# Altium schematic sheet AFE.SchDoc: Plant - AFE
size A4; Author: Carlos de la Fuente; CompanyName: ekuore; DrawnBy: Carlos de la Fuente; Engineer: Carlos de la Fuente; Organization: eKuore; Revision: 0.2; SheetNumber: 4; SheetTotal: 5
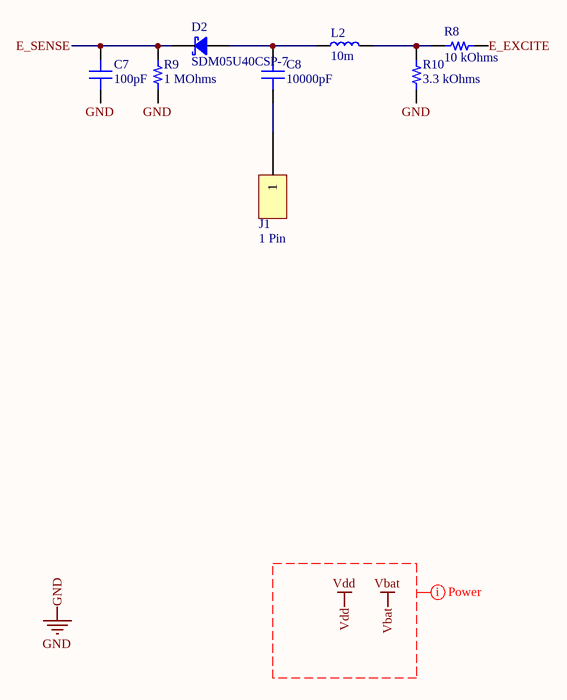
[diagram p0: AFE.SchDoc]

## Parts
C7  100pF  [CAP 0201_0603]
C8  10000pF  [CAP 0201_0603]
D2  SDM05U40CSP-7  [DIODES X3-WLB1006-2]
J1  1 Pin  [HARWIN P70-5100045R]
L2  10m  [IND BOURNS SDR0503]
R8  10 kOhms  [RES 0201_0603]
R9  1 MOhms  [RES 0201_0603]
R10  3.3 kOhms  [RES 0201_0603]

## Nets
GND: C7.1 R9.2 R10.1
E_EXCITE: R8.2
E_SENSE: C7.2 D2.1(K) R9.1
NetC8_1: C8.1 D2.2(A) L2.1
NetC8_2: C8.2 J1.1
NetL2_2: L2.2 R8.1 R10.2

## Layout directives
net class Power: Vbat, Vdd

## Notes on the sheet
- Title
- Size:
- Date:
- A4
- Project:
- Time:
- Sheet
- Drawn By:
- Revision:
- of
- File:

## Library data of the parts
C7 = GRM0335C1H101GA01D: CAP CER 100PF 50V C0G/NP0 0201; Manufacturer: Murata Electronics; Temperature Coefficient: C0G, NP0; Tolerance: ±2%; Part Number: GRM0335C1H101GA01D; Value: 100pF; Applications: General Purpose; Capacitance: 100pF; ComponentLink1Description: Datasheet; ComponentLink1URL: https://search.murata.co.jp/Ceramy/image/img/A01X/G101/ENG/GRM0335C1H101GA01-01.pdf; ComponentLink2Description: DigiKey Link; ComponentLink2URL: http://digikey.com/product-detail/en/murata-electronics/GRM0335C1H101GA01D/490-7751-1-ND/4357967; Device Package: 0201 (0603 Metric); LastUpdated: 02/09/2020 0:58:53; Lifecycle Status: Active; Minimum Order: 1; Mounting Type: Surface Mount, MLCC; Operating Temperature: -55°C ~ 125°C; Package / Case: 0201 (0603 Metric); Packaging: CutTape; PartId: 1001; Part Status: Active; Price: 0.10; Series: GRM; Size / Dimension: 0.024" L x 0.012" W (0.60mm x 0.30mm); Supplier 1: DigiKey; Supplier Part Number 1: 490-7751-1-ND; Thickness (Max): 0.013" (0.33mm); Voltage - Rated: 50V
C8 = GRM033R61A103KA01D: CAP CER 10000PF 10V X5R 0201; Manufacturer: Murata Electronics; Tolerance: ±10%; Part Number: GRM033R61A103KA01D; Value: 10000pF; Applications: General Purpose; Capacitance: 10000pF; ComponentLink1Description: Datasheet; ComponentLink1URL: https://www.murata.com/~/media/webrenewal/support/library/catalog/products/capacitor/mlcc/c02e.ashx?la=en-us; ComponentLink2Description: DigiKey Link; ComponentLink2URL: http://digikey.com/product-detail/en/murata-electronics/GRM033R61A103KA01D/490-3166-1-ND/702707; Device Package: 0201 (0603 Metric); LastUpdated: 02/09/2020 0:59:28; Lifecycle Status: Active; Minimum Order: 1; Mounting Type: Surface Mount, MLCC; Operating Temperature: -55°C ~ 85°C; Package / Case: 0201 (0603 Metric); Packaging: CutTape; PartId: 601; Part Status: Active; Price: 0.10; Series: GRM; Size / Dimension: 0.024" L x 0.012" W (0.60mm x 0.30mm); Supplier 1: DigiKey; Supplier Part Number 1: 490-3166-1-ND; Temperature Coefficient: X5R; Thickness (Max): 0.013" (0.33mm); Voltage - Rated: 10V
D2 = SDM05U40CSP-7: DIODE SCHTKY 40V 0.5A X3WLB1006; Manufacturer: Diodes; Capacitance: 3.5E-11F; Part Number: SDM05U40CSP-7; Revision Date: 19/07/2021; Creation Date: 19/07/2021; Supplier 1: Digi-Key; Supplier Part Number 1: SDM05U40CSP-7DICT-ND; Manufacturer Part Number: SDM05U40CSP-7; Stock 1: 220954; RoHS: Yes; Number of Pins: 2; Min Operating Temperature: -55°C; Max Operating Temperature: 150°C; Packaging: Tape and Reel; Mount: Surface Mount; Manufacturer 1: Diodes; Manufacturer Part Number 1: SDM05U40CSP-7
J1 = P70-5100045R: POGO PIN 4MM SMD; Manufacturer: Harwin; Plating: Gold; Current Rating: 2A; Part Number: P70-5100045R; Value: Pogo Pin; Creation Date: 22/06/2021; Revision Date: 22/06/2021; Supplier 1: Digi-Key; Supplier Part Number 1: 952-3125-ND; Manufacturer Part Number: P70-5100045; Stock 1: 2171; RoHS: Yes; Mount: Surface Mount; Material: Brass; Length: 4.8mm; REACH SVHC: No SVHC; ComponentLink1URL: https://cdn.harwin.com/pdfs/P70-510.pdf?src-supplier=Digi-Key; ComponentLink1Description: https://cdn.harwin.com/pdfs/P70-510.pdf?src-supplier=Digi-Key; ComponentLink2URL: http://www.farnell.com/datasheets/2151574.pdf?src-supplier=Element14; ComponentLink2Description: http://www.farnell.com/datasheets/2151574.pdf?src-supplier=Element14; Manufacturer 1: Harwin; Manufacturer Part Number 1: P70-5100045; RoHS Compliant: Yes
L2 = SDR0503-103JL: IND (0503) 10mH +-5% 0.04A 110R; Manufacturer: Bourns; Tolerance: 5%; Core Material: Ferrite; Self Resonant Frequency: 1MHz; Shielding: Unshielded; Q Factor: 30; Current Rating: 27mA; Test Frequency: 1kHz; Current: 59mA; Saturation Current: 40mA; Value: 10m; Part Number: SDR0503-103JL; Creation Date: 22/06/2021; Revision Date: 22/06/2021; Supplier 1: Digi-Key; Supplier Part Number 1: SDR0503-103JLCT-ND; Manufacturer Part Number: SDR0503-103JL; Stock 1: 3024; RoHS: Yes; Mount: Surface Mount; Case/Package: 0503; Number of Pins: 2; Min Operating Temperature: -40°C; Max Operating Temperature: 125°C; Resistance: 110R; Packaging: Tape and Reel; Length: 5mm; Height: 3.3mm; Width: 3mm; Depth: 5.1mm; REACH SVHC: No SVHC; ComponentLink1URL: https://datasheet.ciiva.com/8515/sdr0503-8515929.pdf?src-supplier=Avnet; ComponentLink1Description: https://datasheet.ciiva.com/8515/sdr0503-8515929.pdf?src-supplier=Avnet; Package Quantity: 500; Termination: SMD/SMT; Military Standard: Not; Height - Seated (Max): 0.13inch; Radiation Hardening: No; ComponentLink2URL: https://datasheet.ciiva.com/6691/sdr0503-6691389.p; ComponentLink2Description: https://datasheet.ciiva.com/6691/sdr0503-6691389.p; ComponentLink3URL: https://datasheet.ciiva.com/6691/sdr0503-6691390.p; ComponentLink3Description: https://datasheet.ciiva.com/6691/sdr0503-6691390.p; ComponentLink4URL: https://datasheet.ciiva.com/6691/sdr0503-6691391.p; ComponentLink4Description: https://datasheet.ciiva.com/6691/sdr0503-6691391.p; ComponentLink5URL: https://datasheet.ciiva.com/8517/sdr0503-8517757.p; ComponentLink5Description: https://datasheet.ciiva.com/8517/sdr0503-8517757.p; ComponentLink6URL: https://datasheet.ciiva.com/28535/1577670-28535983; ComponentLink6Description: https://datasheet.ciiva.com/28535/1577670-28535983; ComponentLink7URL: https://datasheet.ciiva.com/48691/001056092-da-01-; ComponentLink7Description: https://datasheet.ciiva.com/48691/001056092-da-01-; Inductance: 10mH; DC Resistance (DCR): 110R; Max DC Current: 27mA; DC Current: 27mA; Inductance Tolerance: 5%; Manufacturer 1: Bourns; Manufacturer Part Number 1: SDR0503-103JL; RoHS Compliant: Yes; Resistor Type: Wirewound; Series: SDR0503; Body Material: Ferrite; RMS Current (Irms): 27mA; Sample Rate (Hz): 1kHz; Diameter: 5mm
R8 = CRCW020110K0FNED: RES SMD 10K OHM 1% 1/20W 0201; Manufacturer: Vishay Dale; Power (Watts): 0.05W, 1/20W; Temperature Coefficient: ±200ppm/°C; Part Number: CRCW020110K0FNED; Value: 10 kOhms; ComponentLink1Description: Datasheet; ComponentLink1URL: http://www.vishay.com/docs/20052/crcw0201e3.pdf; ComponentLink2Description: DigiKey Link; ComponentLink2URL: http://digikey.com/product-detail/en/vishay-dale/CRCW020110K0FNED/541-10.0KABCT-ND/1183609; Composition: Thick Film; Device Package: 0201 (0603 Metric); Height - Seated (Max): 0.011" (0.28mm); LastUpdated: 02/09/2020 1:06:16; Lifecycle Status: Active; Minimum Order: 1; Number of Terminations: 2; Operating Temperature: -55°C ~ 155°C; Package / Case: 0201 (0603 Metric); Packaging: TapeAndReel; PartId: 2299; Part Status: Active; Price: 0.01; Resistance: 10 kOhms; Series: CRCW; Size / Dimension: 0.024" L x 0.012" W (0.60mm x 0.30mm); Supplier 1: DigiKey; Supplier Part Number 1: 541-10.0KABCT-ND; Supplier Device Package: 0201; Tolerance: ±1%
R9 = RMCF0201FT1M00: RES 1M OHM 1% 1/20W 0201; Manufacturer: Stackpole Electronics Inc; Power (Watts): 0.05W, 1/20W; Temperature Coefficient: ±200ppm/°C; Part Number: RMCF0201FT1M00; Value: 1 MOhms; ComponentLink1Description: Datasheet; ComponentLink1URL: https://www.seielect.com/catalog/sei-rmcf_rmcp.pdf; ComponentLink2Description: DigiKey Link; ComponentLink2URL: http://digikey.com/product-detail/en/stackpole-electronics-inc/RMCF0201FT1M00/RMCF0201FT1M00CT-ND/3905980; Composition: Thick Film; Device Package: 0201 (0603 Metric); Height - Seated (Max): 0.010" (0.26mm); LastUpdated: 02/09/2020 1:06:14; Lifecycle Status: Active; Minimum Order: 1; Number of Terminations: 2; Operating Temperature: -55°C ~ 125°C; Package / Case: 0201 (0603 Metric); Packaging: CutTape; PartId: 3123; Part Status: Active; Price: 0.10; Resistance: 1 MOhms; Series: RMCF; Size / Dimension: 0.024" L x 0.012" W (0.60mm x 0.30mm); Supplier 1: DigiKey; Supplier Part Number 1: RMCF0201FT1M00CT-ND; Supplier Device Package: 0201; Tolerance: ±1%
R10 = CRCW02013K30FNED: RES SMD 3.3K OHM 1% 1/20W 0201; Manufacturer: Vishay Dale; Power (Watts): 0.05W, 1/20W; Temperature Coefficient: ±200ppm/°C; Part Number: CRCW02013K30FNED; Value: 3.3 kOhms; ComponentLink1Description: Datasheet; ComponentLink1URL: http://www.vishay.com/docs/20052/crcw0201e3.pdf; ComponentLink2Description: DigiKey Link; ComponentLink2URL: http://digikey.com/product-detail/en/vishay-dale/CRCW02013K30FNED/541-CRCW02013K30FNEDCT-ND/10448664; Composition: Thick Film; Device Package: 0201 (0603 Metric); Height - Seated (Max): 0.011" (0.28mm); LastUpdated: 02/09/2020 1:06:17; Lifecycle Status: Active; Minimum Order: 1; Number of Terminations: 2; Operating Temperature: -55°C ~ 155°C; Package / Case: 0201 (0603 Metric); Packaging: TapeAndReel; PartId: 2040; Part Status: Active; Price: 0.01; Resistance: 3.3 kOhms; Series: CRCW; Size / Dimension: 0.024" L x 0.012" W (0.60mm x 0.30mm); Supplier 1: DigiKey; Supplier Part Number 1: 541-CRCW02013K30FNEDCT-ND; Supplier Device Package: 0201; Tolerance: ±1%